# Altium project JacdacEdgeConnectorSlotsTest 93.PrjPCB
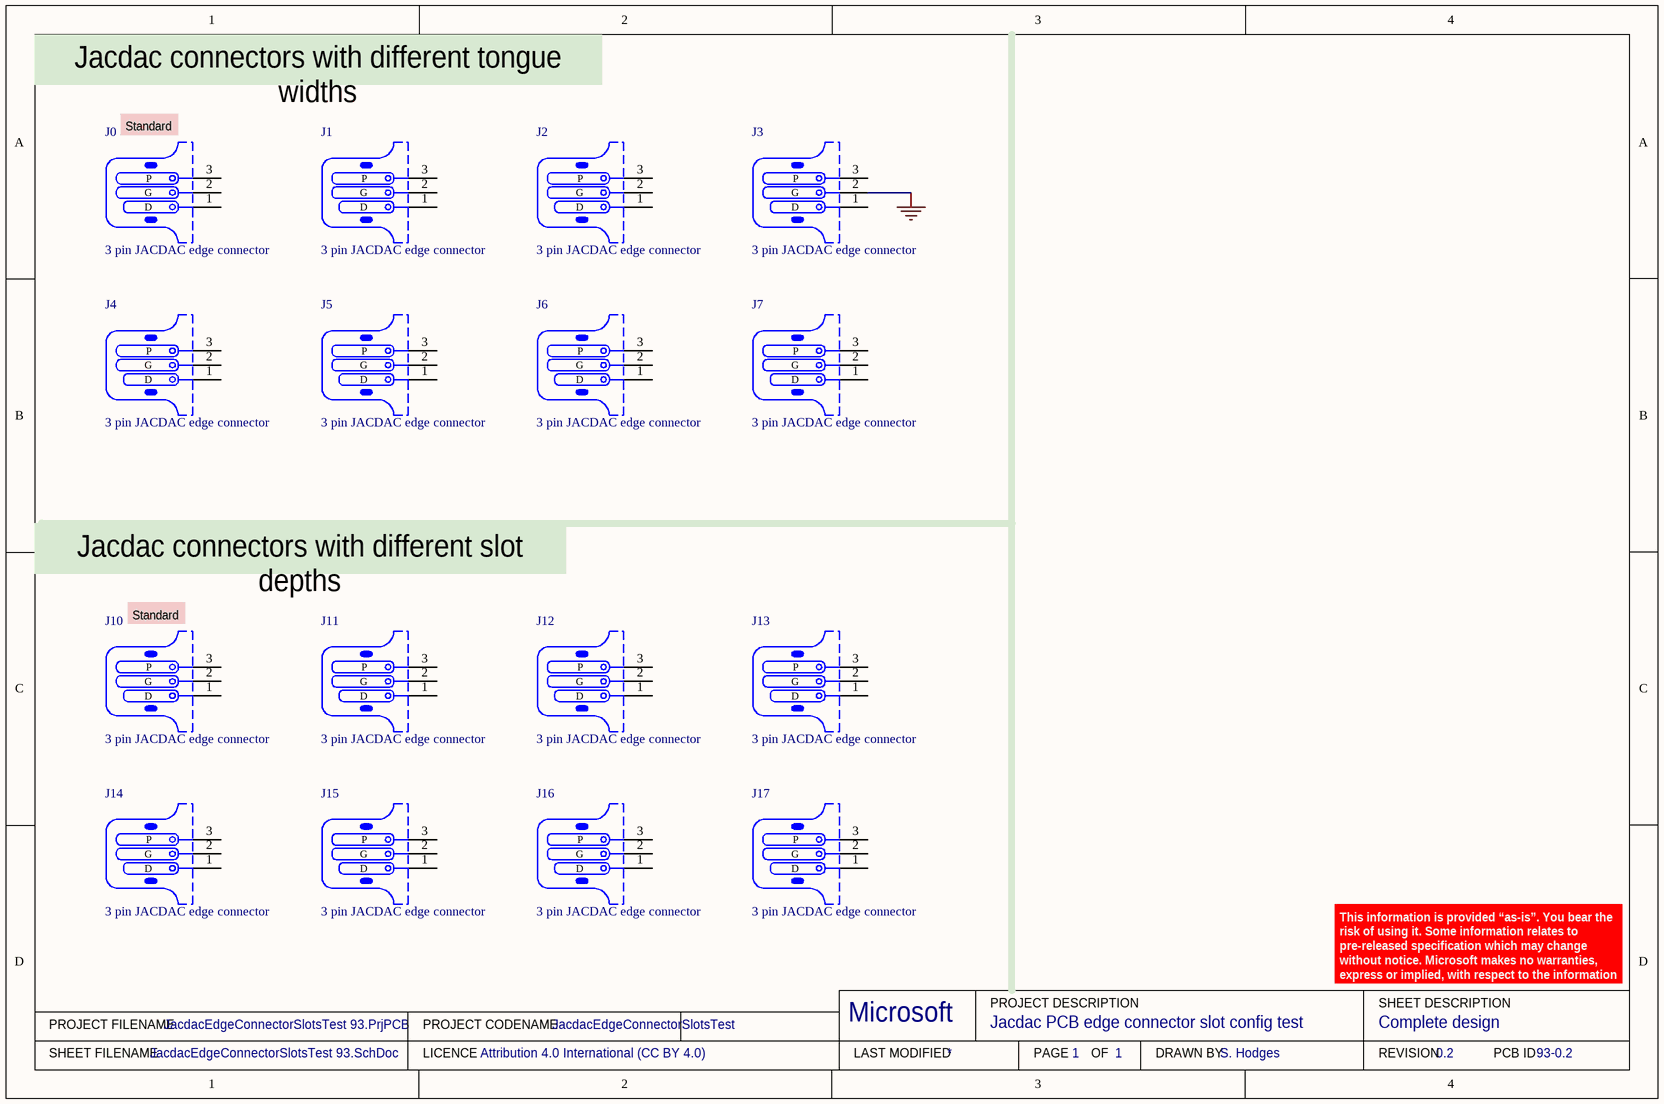
[diagram p0: JacdacEdgeConnectorSlotsTest 93.SchDoc]
ProjectCodeName: JacdacEdgeConnectorSlotsTest; ProjectCodenameDescription: Jacdac PCB edge connector slot config test; ProjectCodenameID: 93; ProjectDrawnBy: S. Hodges; ProjectLicenceTerms: Attribution 4.0 International (CC BY 4.0); ProjectRevision: 0.2
1 sheet, 16 parts. Net scope: global (net labels, ports and power ports of the same name join across sheets).
Board file: JacdacEdgeConnectorSlotsTest 93.PcbDoc

## Sheet JacdacEdgeConnectorSlotsTest 93.SchDoc: Complete design
size A4; DrawnBy: S. Hodges; DocumentNumber: 1; Revision: 0.2; SheetNumber: 1; SheetTotal: 1; VersionControl_RevNumber: 1

### Parts
J0  3 pin JACDAC edge connector  [JACDAC_EDGE_CONNECTOR_NO_TRACES]  (no BOM)
J1  3 pin JACDAC edge connector  [JACDAC_EDGE_CONNECTOR_NO_TRACES]  (no BOM)
J2  3 pin JACDAC edge connector  [JACDAC_EDGE_CONNECTOR_NO_TRACES]  (no BOM)
J3  3 pin JACDAC edge connector  [JACDAC_EDGE_CONNECTOR_NO_TRACES]  (no BOM)
J4  3 pin JACDAC edge connector  [JACDAC_EDGE_CONNECTOR_NO_TRACES]  (no BOM)
J5  3 pin JACDAC edge connector  [JACDAC_EDGE_CONNECTOR_NO_TRACES]  (no BOM)
J6  3 pin JACDAC edge connector  [JACDAC_EDGE_CONNECTOR_NO_TRACES]  (no BOM)
J7  3 pin JACDAC edge connector  [JACDAC_EDGE_CONNECTOR_NO_TRACES]  (no BOM)
J10  3 pin JACDAC edge connector  [JACDAC_EDGE_CONNECTOR_NO_TRACES]  (no BOM)
J11  3 pin JACDAC edge connector  [JACDAC_EDGE_CONNECTOR_NO_TRACES]  (no BOM)
J12  3 pin JACDAC edge connector  [JACDAC_EDGE_CONNECTOR_NO_TRACES]  (no BOM)
J13  3 pin JACDAC edge connector  [JACDAC_EDGE_CONNECTOR_NO_TRACES]  (no BOM)
J14  3 pin JACDAC edge connector  [JACDAC_EDGE_CONNECTOR_NO_TRACES]  (no BOM)
J15  3 pin JACDAC edge connector  [JACDAC_EDGE_CONNECTOR_NO_TRACES]  (no BOM)
J16  3 pin JACDAC edge connector  [JACDAC_EDGE_CONNECTOR_NO_TRACES]  (no BOM)
J17  3 pin JACDAC edge connector  [JACDAC_EDGE_CONNECTOR_NO_TRACES]  (no BOM)

### Nets
GND: J3.2(G)

Not connected (* = marked no-connect by the designer): J0 1(D) 2(G) 3(P); J1 1(D) 2(G) 3(P); J2 1(D) 2(G) 3(P); J3 1(D) 3(P); J4 1(D) 2(G) 3(P); J5 1(D) 2(G) 3(P); J6 1(D) 2(G) 3(P); J7 1(D) 2(G) 3(P); J10 1(D) 2(G) 3(P); J11 1(D) 2(G) 3(P); J12 1(D) 2(G) 3(P); J13 1(D) 2(G) 3(P); J14 1(D) 2(G) 3(P); J15 1(D) 2(G) 3(P); J16 1(D) 2(G) 3(P); J17 1(D) 2(G) 3(P)

### Notes on the sheet
- Jacdac connectors with different tongue widths
- (near J0) Standard
- Jacdac connectors with different slot depths
- (near J10) Standard
- This information is provided “as-is”. You bear the risk of using it. Some information relates to pre-released specification which may change without notice. Microsoft makes no warranties, express or implied, with respect to the information provided here.
- PROJECT FILENAME
- PROJECT CODENAME
- Microsoft
- PROJECT DESCRIPTION
- SHEET DESCRIPTION
- SHEET FILENAME
- LICENCE
- LAST MODIFIED
- PAGE
- OF
- DRAWN BY
- REVISION
- PCB ID

### Library data of the parts
J0-J7 J10-J17 = Jacdac edge connector: 3 pin Jacdac edge connector 1.27mm pitch; Manufacturer Part Number: JACDAC_EDGE_CONNECTOR; Checked By: ?; Created By: D. Gakure; ComponentLink1Description: Yuliang JACDAC cable connector drawing online; ComponentLink1URL: https://github.com/microsoft/jacdac-mdk/blob/main/connector/JACDAC-Connector-by-Yuliang-2020-11-28.pdf; ComponentLink2Description: JACDAC PCB edge connector spec onlin; ComponentLink2URL: https://github.com/microsoft/jacdac-mdk/blob/main/connector/JACDAC_PCB_Edge_Connector_Drawing_JD-PEC-01_rev_01.pdf